# Altium project CTR-Lower-Main-Board-Rev-A.PrjPcb (part 2 of 2)

## Sheet CTR-Lower-Main-Board-Rev-A-Sensors-4.SchDoc: CTR Controller - Sensors
size B; Author: TWL; Organization: OLogic, Inc.; DocumentNumber: 112216; Revision: A; SheetNumber: 4; SheetTotal: 4; PageSetup: Record=PageOptions|CenterHorizontal=True|CenterVertical=True|PrintScale=0.72|XCorrection=1.00|YCorrection=1.00|PrintKind=0|BorderSize=5000000|LeftOffset=0|BottomOffset=0|Orientation=2|PaperLength=1000|PaperWidth=1000|Scale=100|PaperSource=15|PrintQuality=600|MediaType=1|DitherType=10|PrintScaleMode=1|PaperKind=Letter|PaperIndex=1
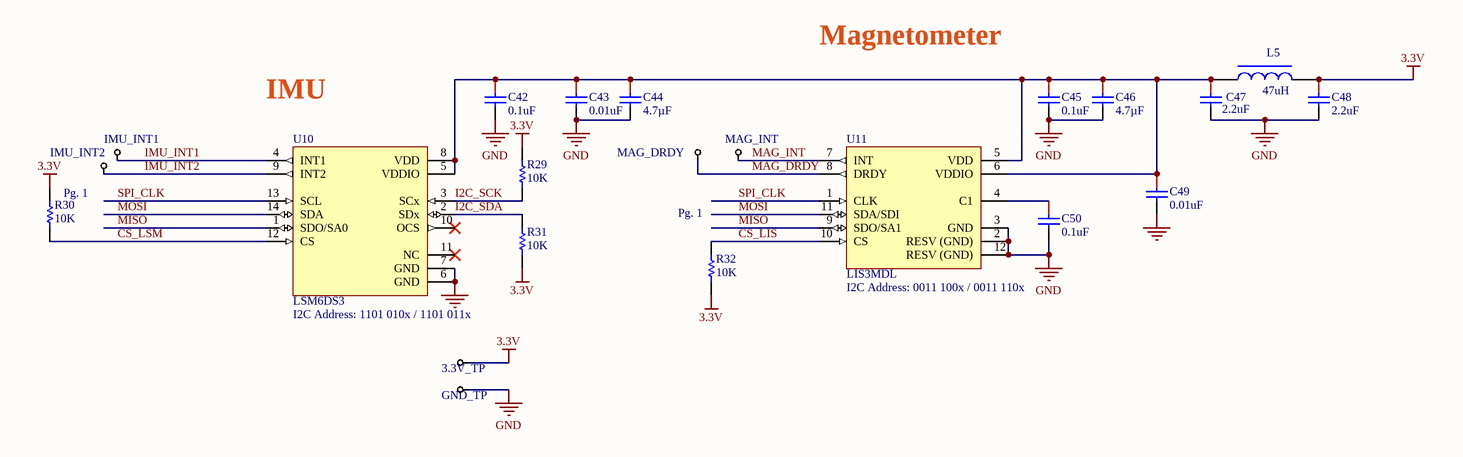
[diagram p2: CTR-Lower-Main-Board-Rev-A-Sensors-4.SchDoc]

### Parts
3.3V_TP  3V  [TestPoint-TH 35 mil]  (value not drawn)
C42  0.1uF  [CAPC0402(1005)_N]
C43  0.01uF  [CAPC0402(1005)_N]
C44  Capacitance: 4.7µF  [CAPC0603(1608)_L]  (hidden comment: 4.7UF 0603)
C45  0.1uF  [CAPC0402(1005)_N]
C46  Capacitance: 4.7µF  [CAPC0603(1608)_L]  (hidden comment: 4.7UF 0603)
C47  2.2uF  [CAPC0402(1005)_N]
C48  2.2uF  [CAPC0402(1005)_N]
C49  0.01uF  [CAPC0402(1005)_N]
C50  0.1uF  [CAPC0402(1005)_N]
GND_TP  GND  [TestPoint-TH 35 mil]  (value not drawn)
IMU_INT1  Test Point  [TestPoint-TH 42 mil]  (value not drawn)
IMU_INT2  Test Point  [TestPoint-TH 42 mil]  (value not drawn)
L5  47uH  [IND-2012 Chip]
MAG_DRDY  Test Point  [TestPoint-TH 42 mil]  (value not drawn)
MAG_INT  Test Point  [TestPoint-TH 42 mil]  (value not drawn)
R29  10K  [RESC0402(1005)_N]
R30  10K  [RESC0402(1005)_N]
R31  10K  [RESC0402(1005)_N]
R32  10K  [RESC0402(1005)_N]
U10  I2C Address: 1101 010x / 1101 011x  [LSM6DS3]  (hidden comment: LSM6DS3)
U11  I2C Address: 0011 100x / 0011 110x  [LIS3MDL]  (hidden comment: LIS3MDL)

### Nets
3.3V: 3.3V_TP.1 C48.1 L5.2 R29.2 R30.2 R31.1 R32.1
GND: C42.2 C43.2 C44.2 C45.2 C46.2 C47.2 C48.2 C49.2 C50.2 GND_TP.1 U10.6(GND) U10.7(GND) U11.2(RESV_(GND)) U11.3(GND) U11.12(RESV_(GND))
CS_LIS: R32.2 U11.10(CS)
CS_LSM: R30.1 U10.12(CS)
I2C_SCK: R29.1 U10.3(SCx)
I2C_SDA: R31.2 U10.2(SDx)
IMU_INT1: IMU_INT1.1 U10.4(INT1)
IMU_INT2: IMU_INT2.1 U10.9(INT2)
MAG_DRDY: MAG_DRDY.1 U11.8(DRDY)
MAG_INT: MAG_INT.1 U11.7(INT)
MISO: U10.1(SDO/SA0) U11.9(SDO/SA1)
MOSI: U10.14(SDA) U11.11(SDA/SDI)
SPI_CLK: U10.13(SCL) U11.1(CLK)
NetC42_1: C42.1 C43.1 C44.1 C45.1 C46.1 C47.1 C49.1 L5.1 U10.5(VDDIO) U10.8(VDD) U11.5(VDD) U11.6(VDDIO)
NetC50_1: C50.1 U11.4(C1)

Not connected (* = marked no-connect by the designer): U10 10(OCS)* 11(NC)*

### Notes on the sheet
- Magnetometer
- IMU
- Pg. 1
- Title
- By:
- Date:
- Number:
- Time:
- Revision:
- Sheet
- of
- OLogic, Inc.
- 1394 Borregas Ave.
- Sunnyvale, CA
- 94089 USA
- File:
- (650) 996-1490

### Library data of the parts
3.3V_TP GND_TP = TestPoint, small: Test Point; ClassName: IMU
C42 C45 C50 = CAP CER 0.1UF 50V 10% X7R 0402: 0.1uF 0402 50V; Manufacturer: TDK Corporation; Manufacturer Part Number: CGA2B3X7R1H104K050BB; Capacitance: 0.1µF; Tolerance: ±10%; Temperature Coefficient: X7R; Supplier 1: Digi-Key; RoHS: RoHS Compliant; Category: Capacitors; Stock 1: 1584397; Pricing 1: 1=0.16, 10=0.11, 100=0.0523, 250=0.044, 500=0.03686, 1000=0.03025, 5000=0.02558 (USD); Packaging: Cut Tape (CT); Voltage - Rated: 50V; Mounting Type: Surface Mount, MLCC; Operating Temperature: -55°C ~ 125°C; Applications: Automotive; Ratings: AEC-Q200; Package / Case: 0402 (1005 Metric); Size / Dimension: 0.039" L x 0.020" W (1.00mm x 0.50mm); Height - Seated (Max): -; Thickness (Max): 0.022" (0.55mm); Lead Spacing: -; Features: -; Lead Style: -; ComponentLink1URL: http://product.tdk.com/en/catalog/datasheets/mlcc_automotive_general_en.pdf; ComponentLink1Description: http://product.tdk.com/en/catalog/datasheets/mlcc_automotive_general_en.pdf; Supplier Part Number 1: 445-6899-1-ND; Creator: osman; ClassName: IMU
C43 C49 = CAP CER 0.01UF 25V 10% X5R 0402: 0.01uF 0402; Manufacturer: Murata Electronics North America; Manufacturer Part Number: GRM155R71E103KA01D; Capacitance: 10000pF; Tolerance: ±10%; Voltage - Rated: 25V; Temperature Coefficient: X7R; Supplier 1: Digi-Key; RoHS: RoHS Compliant; Category: Capacitors; Stock 1: 4802323; Pricing 1: 1=0.1, 10=0.012, 50=0.0066, 100=0.0057, 250=0.00464, 500=0.00396, 1000=0.00309, 5000=0.00258 (USD); Packaging: Cut Tape (CT); Mounting Type: Surface Mount, MLCC; Operating Temperature: -55°C ~ 125°C; Applications: General Purpose; Ratings: -; Package / Case: 0402 (1005 Metric); Size / Dimension: 0.039" L x 0.020" W (1.00mm x 0.50mm); Height - Seated (Max): -; Thickness (Max): 0.022" (0.55mm); Lead Spacing: -; Features: -; Lead Style: -; ComponentLink1URL: http://www.murata.com/~/media/webrenewal/support/library/catalog/products/capacitor/mlcc/c02e.ashx; ComponentLink1Description: http://www.murata.com/~/media/webrenewal/support/library/catalog/products/capacitor/mlcc/c02e.ashx; Supplier Part Number 1: 490-1312-1-ND; ClassName: IMU
C44 C46 = CAP CER 4.7UF 16V 10% X5R 0603: Manufacturer: Taiyo Yuden; Manufacturer Part Number: EMK107ABJ475KA-T; Tolerance: ±10%; Voltage - Rated: 16V; Temperature Coefficient: X5R; ClassName: *; Supplier 1: Digi-Key; RoHS: RoHS Compliant; Category: Capacitors; Stock 1: 498907; Pricing 1: 1=0.26, 10=0.216, 50=0.1216, 100=0.108, 250=0.081, 500=0.07154, 1000=0.06345 (USD); Packaging: Cut Tape (CT); Mounting Type: Surface Mount, MLCC; Operating Temperature: -55°C ~ 85°C; Applications: General Purpose; Ratings: -; Package / Case: 0603 (1608 Metric); Size / Dimension: 0.063" L x 0.031" W (1.60mm x 0.80mm); Height - Seated (Max): -; Thickness (Max): 0.035" (0.90mm); Lead Spacing: -; Features: -; Lead Style: -; ComponentLink1URL: http://www.yuden.co.jp/or/product/category/capacitor/EMK107ABJ475KA-T.pdf; ComponentLink1Description: http://www.yuden.co.jp/or/product/category/capacitor/EMK107ABJ475KA-T.pdf; Supplier Part Number 1: 587-2786-1-ND; Creator: osman
C47 C48 = CAP CER 2.2UF 35V 10% X5R 0402: 2.2uF 0402; Manufacturer: TDK Corporation; Manufacturer Part Number: C1005X5R1V225K050BC; Tolerance: ±10%; Voltage - Rated: 35V; Temperature Coefficient: X5R; Capacitance: 2.2µF; Supplier 1: Digi-Key; RoHS: RoHS Compliant; Category: Capacitors; Stock 1: 43689; Pricing 1: 1=0.32, 10=0.28, 100=0.14, 250=0.112, 500=0.102, 1000=0.092, 5000=0.076 (USD); Packaging: Cut Tape (CT); Mounting Type: Surface Mount, MLCC; Operating Temperature: -55°C ~ 85°C; Applications: General Purpose; Ratings: -; Package / Case: 0402 (1005 Metric); Size / Dimension: 0.039" L x 0.020" W (1.00mm x 0.50mm); Height - Seated (Max): -; Thickness (Max): 0.022" (0.55mm); Lead Spacing: -; Features: -; Lead Style: -; ComponentLink1URL: http://product.tdk.com/en/catalog/datasheets/mlcc_commercial_general_en.pdf; ComponentLink1Description: http://product.tdk.com/en/catalog/datasheets/mlcc_commercial_general_en.pdf; Creator: osman; Supplier Part Number 1: 445-9028-1-ND; ClassName: IMU
IMU_INT1 IMU_INT2 MAG_DRDY MAG_INT = TestPoint, small: ClassName: IMU
L5 = INDUCTOR MULTILAYER 47UH 100mA 0805: 47uH 0805; Manufacturer: TDK Corporation; Manufacturer Part Number: MLZ2012M470WT000; Material - Core: Ferrite; Inductance: 47µH; Tolerance: ±20%; Current Rating: 170mA; Current - Saturation: 50mA; Shielding: Shielded; DC Resistance (DCR): 3.7 Ohm; Frequency - Self Resonant: 20MHz; Frequency - Test: 2MHz; Supplier 1: Digi-Key; RoHS: RoHS Compliant; Category: Inductors, Coils, Chokes; Stock 1: 47288; Pricing 1: 1=0.14, 10=0.125, 50=0.0976, 100=0.0875, 500=0.075, 1000=0.065 (USD); Packaging: Cut Tape (CT); Type: Multilayer; Q @ Freq: -; Operating Temperature: -55°C ~ 125°C; Mounting Type: Surface Mount; Package / Case: 0805 (2012 Metric); Size / Dimension: 0.079" L x 0.049" W (2.00mm x 1.25mm); Height - Seated (Max): 0.057" (1.45mm); Supplier Device Package: 0805 (2012 Metric); ComponentLink1URL: http://www.tdk.co.jp/tefe02/e533_mlz.pdf; ComponentLink1Description: http://www.tdk.co.jp/tefe02/e533_mlz.pdf; Supplier Part Number 1: 445-6400-1-ND; ClassName: IMU
R29-R32 = RES 10K OHM 5% 1/10W 0402: 10K 0402; Manufacturer: Panasonic Electronic Components; Manufacturer Part Number: ERJ-2GEJ103X; Tolerance: ±5%; Power (Watts): 0.1W, 1/10W; Temperature Coefficient: ±200ppm/°C; ClassName: IMU; Creator: ted; Supplier 1: Digi-Key; RoHS: RoHS Compliant; Category: Resistors; Stock 1: 5772999; Pricing 1: 1=0.1, 50=0.0106, 100=0.0078, 250=0.00596, 500=0.00476, 1000=0.0035, 5000=0.00251 (USD); Packaging: Cut Tape (CT); Resistance (Ohms): 10k; Composition: Thick Film; Features: Automotive AEC-Q200; Operating Temperature: -55°C ~ 155°C; Package / Case: 0402 (1005 Metric); Supplier Device Package: 0402; Size / Dimension: 0.039" L x 0.020" W (1.00mm x 0.50mm); Height: 0.016" (0.40mm); Number of Terminations: 2; ComponentLink1URL: http://industrial.panasonic.com/www-cgi/jvcr13pz.cgi?E+PZ+3+AOA0001+ERJ2GEJ103X+7+WW; ComponentLink1Description: http://industrial.panasonic.com/www-cgi/jvcr13pz.cgi?E+PZ+3+AOA0001+ERJ2GEJ103X+7+WW; Supplier Part Number 1: P10KJCT-ND
U10 = LSM6DS3: 3D ACC/GYRO INEMO 14VFLGA; Manufacturer: STMicroelectronics; Sensor Type: Accelerometer, Gyroscope, 3 Axis; Output Type: I²C, SPI; Creator: osman; Supplier 1: Digi-Key; RoHS: RoHS Compliant; Category: Sensors, Transducers; Stock 1: 4296; Pricing 1: 1=4.28, 10=3.44, 100=3.06, 250=2.82, 500=2.54, 1000=2.14, 2500=2.03 (USD); ComponentLink1URL: http://www.st.com/web/en/resource/technical/document/datasheet/DM00133076.pdf; ComponentLink1Description: http://www.st.com/web/en/resource/technical/document/datasheet/DM00133076.pdf; Supplier Part Number 1: 497-15383-1-ND; Manufacturer Part Number: LSM6DS3
U11 = LIS3MDL: IC MAGNETOMETER 3-AXIS 12LGA; Manufacturer: STMicroelectronics; Sensing Range: ±4G, ±8G, ±12G, ±16G; Voltage - Supply: 1.9 V ~ 3.6 V; Output Type: I²C, SPI; Creator: osman; Supplier 1: Digi-Key; RoHS: RoHS Compliant; Category: Sensors, Transducers; Stock 1: 5055; Pricing 1: 1=1.53, 10=1.24, 100=0.996, 500=0.873, 1000=0.723, 2500=0.673 (USD); Packaging: *; Type: Compass - Three Axis; Current - Supply: -; Current - Output (Max): -; Features: -; Operating Temperature: -40°C ~ 85°C; Package / Case: 12-VFLGA; Supplier Device Package: *; ComponentLink1URL: http://www.st.com/web/en/resource/technical/document/datasheet/DM00075867.pdf; ComponentLink1Description: http://www.st.com/web/en/resource/technical/document/datasheet/DM00075867.pdf; Supplier Part Number 1: 497-13892-1-ND; Manufacturer Part Number: LIS3MDL

## Nets that join several sheets
3.3V: CTR-Lower-Main-Board-Rev-A-Power-3 (C31.1 U8.5), CTR-Lower-Main-Board-Rev-A-Sensors-4 (7 pins)
GND: CTR-Lower-Main-Board-Rev-A-Motor-2 (18 pins), CTR-Lower-Main-Board-Rev-A-Power-3 (46 pins), CTR-Lower-Main-Board-Rev-A-Sensors-4 (15 pins)
VSW: CTR-Lower-Main-Board-Rev-A-Motor-2 (12 pins), CTR-Lower-Main-Board-Rev-A-Power-3 (11 pins)
I2C_SCK: CTR-Lower-Main-Board-Rev-A-Power-3 (CN2.5 I2C_SCL.1), CTR-Lower-Main-Board-Rev-A-Sensors-4 (R29.1 U10.3)